# Altium schematic sheet Ribbon Breakout.SchDoc
size A
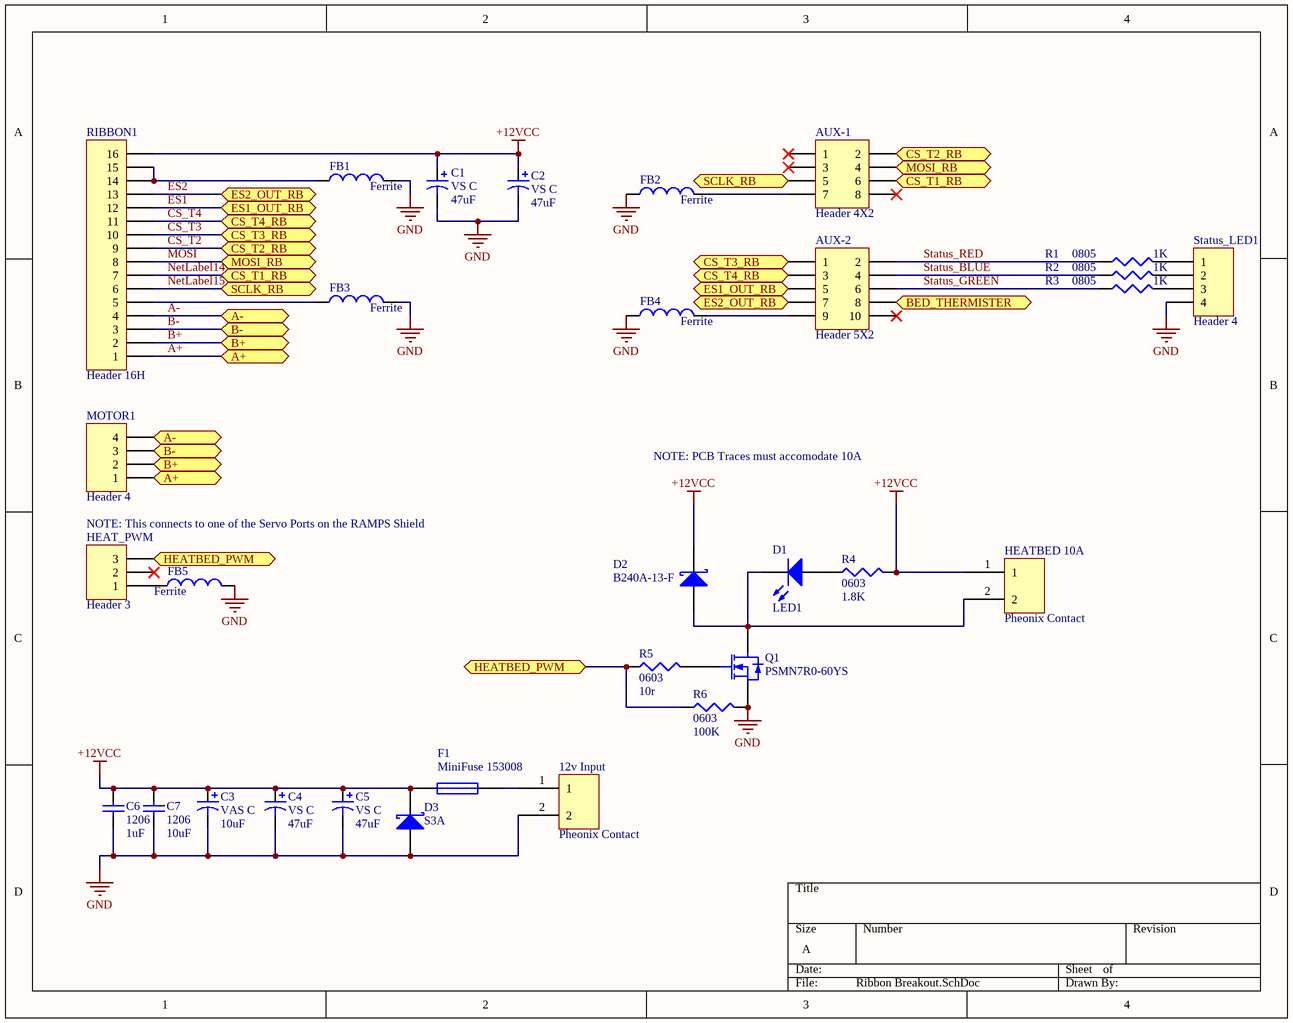
[diagram p0: Ribbon Breakout.SchDoc]

## Parts
12v_Input  Pheonix Contact  [con-phoenix-508]
AUX-1  Header 4X2  [HDR2X4]
AUX-2  Header 5X2  [HDR2X5]
C1  VS C  value 47uF  [Panasonic VS C]
C2  VS C  value 47uF  [Panasonic VS C]
C3  VAS C  value 10uF  [Panasonic VS B]
C4  VS C  value 47uF  [Panasonic VS C]
C5  VS C  value 47uF  [Panasonic VS C]
C6  1206  value 1uF  [C1206]
C7  1206  value 10uF  [C1206]
D1  LED1  [SM 0805 polarized]
D2  B240A-13-F  [B240A-13-F]
D3  S3A  [S3A-Schottky]
F1  MiniFuse 153008  [TinyFuseATO_Carrier]
FB1  Ferrite  [SM 0805 - gap trimmed]
FB2  Ferrite  [SM 0805 - gap trimmed]
FB3  Ferrite  [SM 0805 - gap trimmed]
FB4  Ferrite  [SM 0805 - gap trimmed]
FB5  Ferrite  [SM 0805 - gap trimmed]
HEAT_PWM  Header 3  [HDR1X3]
HEATBED_10A  Pheonix Contact  [con-phoenix-508]
MOTOR1  Header 4  [HDR1X4]
Q1  PSMN7R0-60YS  [PSMN7R0-60YS]
R1  0805  value 1K  [SM 0805 - gap trimmed]
R2  0805  value 1K  [SM 0805 - gap trimmed]
R3  0805  value 1K  [SM 0805 - gap trimmed]
R4  0603  value 1.8K  [J1-0603]
R5  0603  value 10r  [J1-0603]
R6  0603  value 100K  [J1-0603]
RIBBON1  Header 16H  [HDR1X16H]
Status_LED1  Header 4  [HDR1X4]

## Ports
A+, A-, B+, B-, BED_THERMISTER, CS_T1_RB, CS_T2_RB, CS_T3_RB, CS_T4_RB, ES1_OUT_RB, ES2_OUT_RB, HEATBED_PWM, MOSI_RB, SCLK_RB

## Nets
+12VCC: C1.1 C2.1 C3.1 C4.1 C5.1 C6.2 C7.2 D2.1(A) D3.2(K) F1.1 HEATBED_10A.1 R4.2 RIBBON1.16
GND: 12v_Input.2 C1.2 C2.2 C3.2 C4.2 C5.2 C6.1 C7.1 D3.1(A) FB1.2 FB2.1 FB3.2 FB4.1 FB5.2 Q1.1(S) Q1.2(S) Q1.3(S) R6.2 Status_LED1.4
A+: MOTOR1.1 RIBBON1.1 ; port A+
A-: MOTOR1.4 RIBBON1.4 ; port A-
B+: MOTOR1.2 RIBBON1.2 ; port B+
B-: MOTOR1.3 RIBBON1.3 ; port B-
BED_THERMISTER: AUX-2.8 ; port BED_THERMISTER
CS_T2: AUX-1.2 RIBBON1.9 ; port CS_T2_RB
CS_T3: AUX-2.1 RIBBON1.10 ; port CS_T3_RB
CS_T4: AUX-2.3 RIBBON1.11 ; port CS_T4_RB
ES1: AUX-2.5 RIBBON1.12 ; port ES1_OUT_RB
ES2: AUX-2.7 RIBBON1.13 ; port ES2_OUT_RB
HEATBED_PWM: HEAT_PWM.3 R5.1 R6.1 ; port HEATBED_PWM
MOSI: AUX-1.4 RIBBON1.8 ; port MOSI_RB
NetLabel14: AUX-1.6 RIBBON1.7 ; port CS_T1_RB
NetLabel15: AUX-1.5 RIBBON1.6 ; port SCLK_RB
Status_BLUE: AUX-2.4 R2.1
Status_GREEN: AUX-2.6 R3.1
Status_RED: AUX-2.2 R1.1
Net12v_Input_1: 12v_Input.1 F1.2
NetAUX-1_7: AUX-1.7 FB2.2
NetAUX-2_9: AUX-2.9 FB4.2
NetD1_1: D1.1(A) D2.2(K) HEATBED_10A.2 Q1.5(D)
NetD1_2: D1.2(K) R4.1
NetFB1_1: FB1.1 RIBBON1.14 RIBBON1.15
NetFB3_1: FB3.1 RIBBON1.5
NetFB5_1: FB5.1 HEAT_PWM.1
NetQ1_4: Q1.4(G) R5.2
NetR1_2: R1.2 Status_LED1.1
NetR2_2: R2.2 Status_LED1.2
NetR3_2: R3.2 Status_LED1.3

Not connected (* = marked no-connect by the designer): AUX-1 1* 3* 8*; AUX-2 10*; HEAT_PWM 2*

## Notes on the sheet
- NOTE: PCB Traces must accomodate 10A
- NOTE: This connects to one of the Servo Ports on the RAMPS Shield

## Library data of the parts
12v_Input HEATBED_10A = Pheonix Contact 2X1
AUX-1 = Header 4X2: Header, 4-Pin, Dual row; LatestRevisionDate: 17-Jul-2002; LatestRevisionNote: Re-released for DXP Platform.; Publisher: Altium Limited
AUX-2 = Header 5X2: Header, 5-Pin, Dual row; LatestRevisionDate: 17-Jul-2002; LatestRevisionNote: Re-released for DXP Platform.; Publisher: Altium Limited
C1-C5 = Cap Pol1: Polarized Capacitor (Radial); Published: 8-Jun-2000; LatestRevisionDate: 17-Jul-2002; LatestRevisionNote: Re-released for DXP Platform.; PackageReference: RB7.6-15; Publisher: Altium Limited; PackageDescription: Polarized Capacitor (Radial); 2 Leads
C6 C7 = Cap Semi: Capacitor (Semiconductor SIM Model); Published: 8-Jun-2000; LatestRevisionDate: 29-May-2009; LatestRevisionNote: IPC-7351 Footprint Added.; PackageReference: C1206; Publisher: Altium Limited; PackageDescription: Chip Capacitor
D1 = LED1: Typical RED GaAs LED; Published: 8-Jun-2000; LatestRevisionDate: 08-Jul-2005; LatestRevisionNote: Mech Layer 1 removed.; PackageReference: LED-1; Publisher: Altium Limited; PackageDescription: LED; 2 Leads
D2 D3 = D Schottky: Schottky Diode; Published: 8-Jun-2000; LatestRevisionDate: 17-Jul-2002; LatestRevisionNote: Re-released for DXP Platform.; PackageReference: SMB; Publisher: Altium Limited; PackageDescription: DO-214-AA/SMB; 2 C-Bend Leads; Body 5.3 x 3.6 mm, inc. leads (LxW); Code_JEDEC: DO-214-AA
F1 = Fuse 1: Fuse; Published: 8-Jun-2000; LatestRevisionDate: 17-Jul-2002; LatestRevisionNote: Re-released for DXP Platform.; PackageReference: PIN-W2/E2.8; Publisher: Altium Limited; PackageDescription: Thru-Hole; 2 Leads
FB1-FB5 = Inductor: Code_IEC: 1005; Published: 8-Jun-2000; LatestRevisionDate: 17-Jul-2002; LatestRevisionNote: Re-released for DXP Platform.; PackageReference: 0402-A; Publisher: Altium Limited; Code_JEITA: 0402
HEAT_PWM = Header 3: Header, 3-Pin; LatestRevisionDate: 17-Jul-2002; LatestRevisionNote: Re-released for DXP Platform.; Publisher: Altium Limited
MOTOR1 Status_LED1 = Header 4: Header, 4-Pin; LatestRevisionDate: 17-Jul-2002; LatestRevisionNote: Re-released for DXP Platform.; Publisher: Altium Limited
Q1 = PSMN7R0-60YS: N-Channel MOSFET; Published: 8-Jun-2000; LatestRevisionDate: 17-Jul-2002; LatestRevisionNote: Re-released for DXP Platform.; PackageVersion: 1995/1996; PackageReference: E3; Publisher: Altium Limited; PackageDescription: TO, Flat Index; 3 In-Line, Axial Leads; Body Dia. 4.6mm; Lead Dia. 0.5 mm (max)
R1-R6 = Res3: Resistor; Published: 8-Jun-2000; LatestRevisionDate: 29-May-2009; LatestRevisionNote: IPC-7351 Footprint Added.; PackageReference: J1-0603; Publisher: Altium Limited; PackageDescription: Chip Resistor
RIBBON1 = Header 16H: Header, 16-Pin, Right Angle; LatestRevisionDate: 17-Jul-2002; LatestRevisionNote: Re-released for DXP Platform.; Publisher: Altium Limited